# EAGLE design UberHidBoard1 (EAGLE 9.4.0)
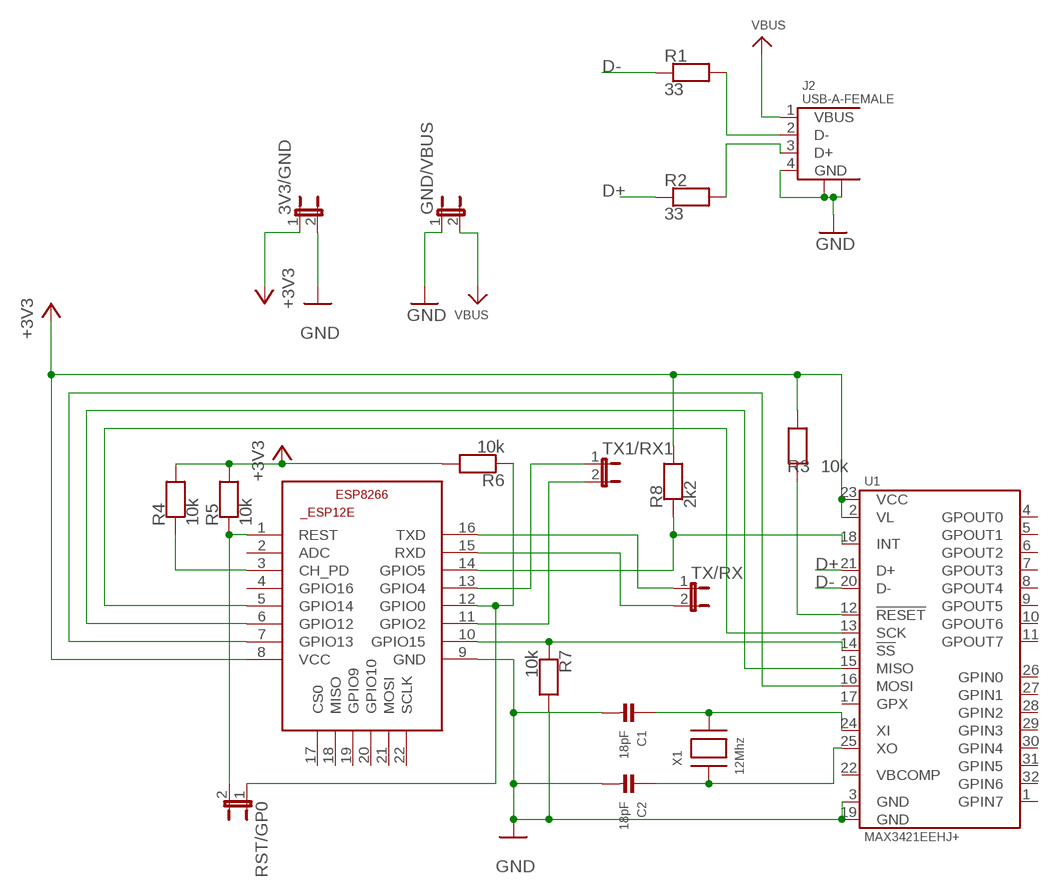
[diagram p0: schematic, sheet 1]

## Parts
3V3/GND  JUMPER2  [JUMPER2]
C1  18pF  CAP_CERAMIC0805  [0805]
C2  18pF  CAP_CERAMIC0805  [0805]
ESP8266  ESP8266-12EESP12E  [ESP8266-ESP12E]
GND/VBUS  JUMPER2  [JUMPER2]
J2  USB-A-FEMALE  [USB-A-FEMALE]
R1  33  RESISTOR0805  [0805]
R2  33  RESISTOR0805  [0805]
R3  10k  RESISTOR0805  [0805]
R4  10k  RESISTOR0805  [0805]
R5  10k  RESISTOR0805  [0805]
R6  10k  RESISTOR0805  [0805]
R7  10k  RESISTOR0805  [0805]
R8  2k2  RESISTOR0805  [0805]
RST/GP0  JUMPER2  [JUMPER2]
TX1/RX1  JUMPER2  [JUMPER2]
TX/RX  JUMPER2  [JUMPER2]
U1  MAX3421EEHJ+  [LQFP-23]
X1  12Mhz  XTAL-3.2X1.5  [XTAL3215]

## Nets
+3V3: 3V3/GND.1 ESP8266.8(VCC) R3.2 R4.2 R5.2 R6.2 R8.2 U1.2(VL) U1.23(VCC)
D+: R2.1 U1.21(D+)
D-: R1.1 U1.20(D-)
GND: 3V3/GND.2 C1.2 C2.2 ESP8266.9(GND) GND/VBUS.1 J2.4(GND) J2.P$1 J2.P$2 R7.2 U1.3(GND) U1.19(GND)
N$1: J2.2(D-) R1.2
N$2: J2.3(D+) R2.2
N$3: ESP8266.10(GPIO15) R7.1 U1.14(!SS)
N$4: ESP8266.7(GPIO13) U1.16(MOSI)
N$5: ESP8266.6(GPIO12) U1.15(MISO)
N$6: ESP8266.5(GPIO14) U1.13(SCK)
N$7: R3.1 U1.12(!RESET)
N$8: ESP8266.14(GPIO5) R8.1 U1.18(INT)
N$10: C2.1 U1.25(XO) X1.P$1
N$11: C1.1 U1.24(XI) X1.P$2
N$12: ESP8266.13(GPIO4) TX1/RX1.1
N$13: ESP8266.3(CH_PD) R4.1
N$14: ESP8266.1(REST) R5.1 RST/GP0.2
N$15: ESP8266.12(GPIO0) R6.1 RST/GP0.1
N$16: ESP8266.16(TXD) TX/RX.1
N$17: ESP8266.15(RXD) TX/RX.2
N$18: ESP8266.11(GPIO2) TX1/RX1.2
VBUS: GND/VBUS.2 J2.1(VBUS)
Unconnected: ESP8266.2(ADC) ESP8266.4(GPIO16) ESP8266.17(CS0) ESP8266.18(MISO) ESP8266.19(GPIO9) ESP8266.20(GPIO10) ESP8266.21(MOSI) ESP8266.22(SCLK) U1.1(GPIN7) U1.4(GPOUT0) U1.5(GPOUT1) U1.6(GPOUT2) U1.7(GPOUT3) U1.8(GPOUT4) U1.9(GPOUT5) U1.10(GPOUT6) U1.11(GPOUT7) U1.17(GPX) U1.22(VBCOMP) U1.26(GPIN0) U1.27(GPIN1) U1.28(GPIN2) U1.29(GPIN3) U1.30(GPIN4) U1.31(GPIN5) U1.32(GPIN6)

## Library data of the parts
3V3/GND GND/VBUS RST/GP0 TX1/RX1 TX/RX = microbuilder:JUMPER2: JUMPER - 2 Pins
C1 C2 = microbuilder:CAP_CERAMIC: Ceramic Capacitors 0402 - 0402 Surface Mount Capacitors 16pF 50V 5% [Digikey: 445-4899-2-ND] 18pF 50V 5% [Digikey: 490-1281-2-ND] 22pF 50V 5% [Digikey: 490-1283-2-ND] 68pF 50V 5% [Digikey: 490-1289-2-ND] 0.1uF 10V 10% [Digikey: 490-1318-2-ND] 1.0uF 6.3V 10% [Digikey: 490-1320-2-ND] 0603 - 0603 Surface Mount Capacitors 16 pF 50V 5% [Digikey: 445-5051-2-ND] 22 pF 50V [Digikey: PCC220ACVTR-ND] 33 pF 50V 5% [Digikey: 490-1415-1-ND] 56pF 50V 5% [Digikey: 490-1421-1-ND] 220pF 50V 5% [Digikey: 445-1285-1-ND] 680 pF 50V 2200 pF 50V 5% C0G [Digikey: 445-1297-1-ND] 5600 pF 100V 5% X7R [Digikey: 478-3711-1-ND] 0.1 µF 25V 10% [Digikey: PCC2277TR-ND] 0.22 µF 16V 10% X7R [Digikey: 445-1318-1-ND] 1.0 µF 25V 10% [Digikey: 445-5146-2-ND] 0603 - RF Specific 3pF 250V +/-0.1pF RF [Digikey: 712-1347-1-ND] 18 pF 250V 5% [Digikey: 478-3505-1-ND or 712-1322-1-ND] 56 pF 250V 5% C0G RF [Digikey: 490-4867-1-ND] 68 pF 250V RF [Digikey: 490-4868-1-ND] 0805 - 0805 Surface Mount Capacitors 220 pF 250V 2% RF Ceramic Capacitor [Digikey: 712-1398-1-ND] 1000 pF 50V 2% NP0 Ceramic Capacitor [Digikey: 478-3760-1-ND] 0.1 µF 25V 10% Ceramic Capacitor [Digikey: PCC1828TR-ND] 1.0 µF 16V 10% Ceramic Capacitor[Digikey: 490-1691-2-ND] 10.0 µF 10V 10% Ceramic Capacitor[Digikey: 709-1228-1-ND] 10.0 uF 16V 10% Ceramic Capacitor [Digikey: 478-5165-2-ND] 47 uF 6.3V 20% Ceramic Capacitor [Digikey: 587-1779-1-ND or 399-5506-1-ND] 1206 - 1206 Surface Mount Capacitors 47uF 10V 20% Ceramic Capacitor [Digikey: 490-5528-1-ND or 399-5508-1-ND or 445-6010-1-ND] 100uF 6.3V -20%, +80% Y5V Ceramic Capacitor (Digikey: 490-4512-1-ND, Mouser: 81-GRM31CF50J107ZE1L)
ESP8266 = esp12e:ESP8266-12E: ESP8266-12E Library for Eagle CAD The author not responsible for any damages or errors!. Created by Suhail jr.lt;/author>
J2 = Connectors:USB
R1-R8 = microbuilder:RESISTOR: Resistors 0402 - 0402 Surface Mount Package 22 Ohm 1% 1/16W [Digikey: 311-22.0LRTR-ND] 33 Ohm 5% 1/16W 1.0K 5% 1/16W 1.5K 5% 1/16W 2.0K 1% 1/16W 10.0K 1% 1/16W [Digikey: 311-10.0KLRTR-ND] 10.0K 5% 1/16W [Digikey: RMCF0402JT10K0TR-ND] 12.1K 1% 1/16W [Digikey: 311-22.0LRTR-ND] 100.0K 5% 1/16W 0603 - 0603 Surface Mount Package 0 Ohm 1/10 Watt 1% Resistor 15 Ohm 1/10 Watt 1% Resistor 33 Ohm 1/10 Watt 1% Resistor 49.9 Ohm 1/10 Watt 1% Resistor 100 Ohm 1/10 Watt 1% Resistor 150 Ohm 1/10 Watt 1% Resistor 240 Ohm 1/10 Watt 1% Resistor 390 Ohm 1/10 Watt 1% Resistor 560 Ohm 1/10 Watt 1% Resistor 680 Ohm 1/10 Watt 1% Resistor 750 Ohm 1/10 Watt 1% Resistor 1.0K Ohm 1/10 Watt 1% Resistor 1.5K Ohm 1/10 Watt 1% Resistor 2.0K Ohm 1/10 Watt 1% Resistor 2.2K Ohm 1/10 Watt 1% Resistor 3.3K Ohm 1/10 Watt 1% Resistor 4.7K Ohm 1/10 Watt 1% Resistor 10.0K Ohm 1/10 Watt 1% Resistor 12.0K Ohm 1/10 Watt 1% Resistor 12.1K Ohm 1/10 Watt 1% Resistor 20.0K Ohm 1/10 Watt 1% Resistor 33.0K Ohm 1/10 Watt 1% Resistor 100.0K Ohm 1/10 Watt 1% Resistor 0805 - 0805 Surface Mount Package 0 Ohm 1/8 Watt 1% Resistor 33 Ohm 1/8 Watt 1% Resistor 100 Ohm 1/8 Watt 1% Resistor 150 Ohm 1/8 Watt 1% Resistor 200 Ohm 1/8 Watt 1% Resistor 240 Ohm 1/8 Watt 1% Resistor 330 Ohm 1/8 Watt 1% Resistor 390 Ohm 1/8 Watt 1% Resistor 470 Ohm 1/8 Watt 1% Resistor 1.0K Ohm 1/8 Watt 1% Resistor 1.5K Ohm 1/8 Watt 1% Resistor 2.0K Ohm 1/8 Watt 1% Resistor 4.7K Ohm 1/8 Watt 1% Resistor 5.1K Ohm 1/8 Watt 1% Resistor 5.6K Ohm 1/8 Watt 1% Resistor 10.0K Ohm 1/8 Watt 1% Resistor 22.0K Ohm 1/8 Watt 1% Resistor 33.0K Ohm 1/8 Watt 1% Resistor 100K Ohm 1/8 Watt 1% Resistor 1206 - 1206 Surface Mount Package 2012 - 2010 Surface Mount Package 0.11 Ohm 1/2 Watt 1% Resistor - Digikey: RHM.11UCT-ND
U1 = Maxim:MAX3421
X1 = adafruit:XTAL: Low cost SMT crystals, no capacitors included http://www.ladyada.net/library/eagle

## Board
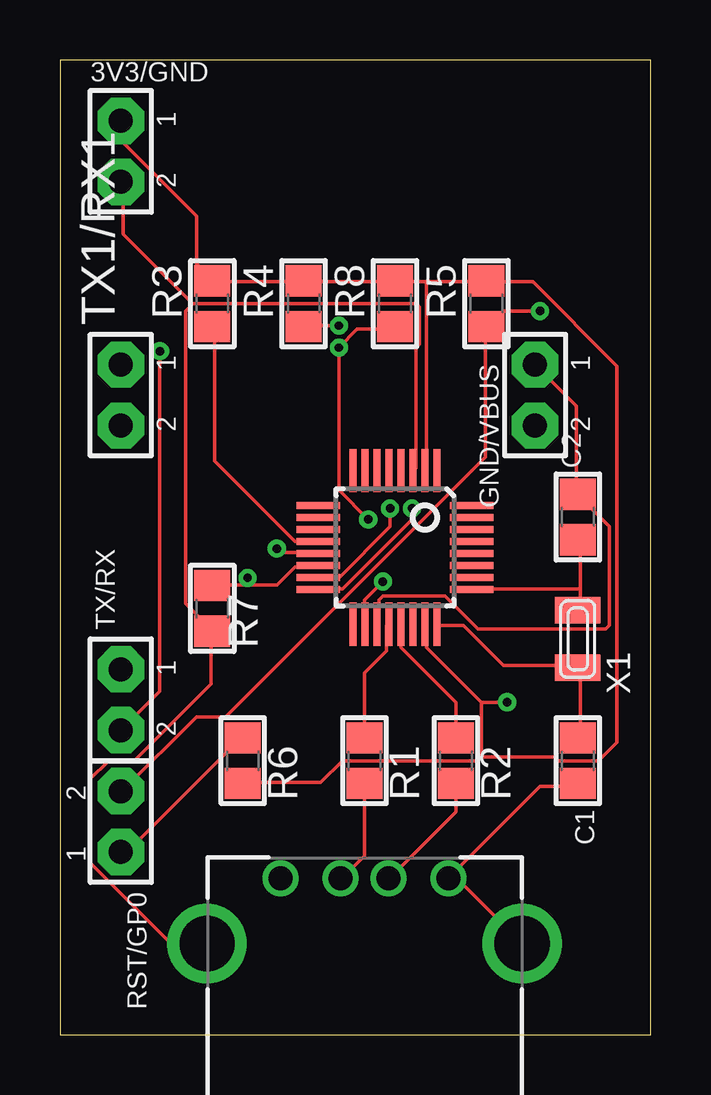
[diagram p1: board, top side]
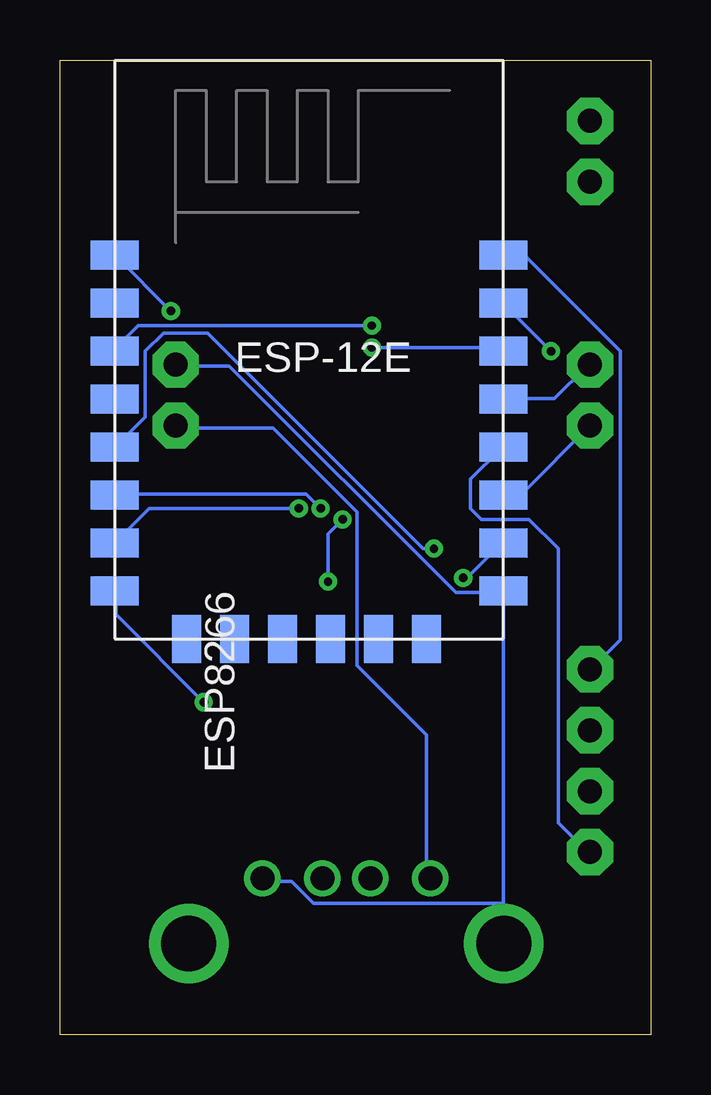
[diagram p2: board, bottom side, seen from below]

Size 24.64 x 40.64 mm. Coordinates in mm from the lower left corner, seen from the top.
Outline: 0,0 24.64,0 24.64,40.64 0,40.64 0,0
Copper layers (1*16): Top 0.035mm / dielectric 1.5mm / Bottom 0.035mm
Design rules "default": minimum track width 6mil, minimum drill 0.35mm, track to track 6mil, track to pad 6mil, pad to pad 6mil, via to via 6mil, smd to smd 6mil, copper to edge 40mil, drill to drill 6mil, minimum pad ring 10mil, minimum via ring 8mil, stop-mask expansion 4mil, vias tented up to drill 0mil, thermal gap 10mil

### Footprints (pad centres in the part's own frame; a part is rotated, then mirrored left to right if it is on the bottom)
JUMPER2 = drill 1 pad 1.93 octagon: 1 2.54,0; 2 0,0
0805 = smd 1.3 x 1.5: 1 -0.95,0; 2 0.95,0
ESP8266-ESP12E = smd 2 x 1.2: 1 -7.62,5.84; 2 -7.62,3.84; 3 -7.62,1.84; 4 -7.62,-0.16; 5 -7.62,-2.16; 6 -7.62,-4.16; 7 -7.62,-6.16; 8 -7.62,-8.16; 9 8.58,-8.16; 10 8.58,-6.16; 11 8.58,-4.16; 12 8.58,-2.16; 13 8.58,-0.16; 14 8.58,1.84; 15 8.58,3.84; 16 8.58,5.84 | smd 1.2 x 2: 17 -4.62,-10.16; 18 -2.62,-10.16; 19 -0.62,-10.16; 20 1.38,-10.16; 21 3.38,-10.16; 22 5.38,-10.16
USB-A-FEMALE = drill 1: 1 -3.5,2.71; 2 -1,2.71; 3 1,2.71; 4 3.5,2.71 | drill 2.3: P$1 6.57,0; P$2 -6.57,0
LQFP-23 = smd 1.8 x 0.3: 1 -3.2,1.75; 2 -3.2,1.25; 3 -3.2,0.75; 4 -3.2,0.25; 5 -3.2,-0.25; 6 -3.2,-0.75; 7 -3.2,-1.25; 8 -3.2,-1.75; 17 3.2,-1.75; 18 3.2,-1.25; 19 3.2,-0.75; 20 3.2,-0.25; 21 3.2,0.25; 22 3.2,0.75; 23 3.2,1.25; 24 3.2,1.75 | smd 0.3 x 1.8: 9 -1.75,-3.2; 10 -1.25,-3.2; 11 -0.75,-3.2; 12 -0.25,-3.2; 13 0.25,-3.2; 14 0.75,-3.2; 15 1.25,-3.2; 16 1.75,-3.2; 25 1.75,3.2; 26 1.25,3.2; 27 0.75,3.2; 28 0.25,3.2; 29 -0.25,3.2; 30 -0.75,3.2; 31 -1.25,3.2; 32 -1.75,3.2
XTAL3215 = smd 1.1 x 1.9: P$1 1.2,0; P$2 -1.2,0

### Placement (x,y rotation side)
3V3/GND  2.54,35.56 90 top
C1  21.59,11.43 270 top
C2  21.59,21.59 90 top
ESP8266  14.73,26.67 0 bottom
GND/VBUS  19.81,25.4 90 top
J2  12.7,3.81 0 top
R1  12.7,11.43 270 top
R2  16.51,11.43 270 top
R3  6.35,30.48 90 top
R4  10.16,30.48 90 top
R5  17.78,30.48 90 top
R6  7.62,11.43 270 top
R7  6.35,17.78 270 top
R8  13.97,30.48 90 top
RST/GP0  2.54,10.16 270 top
TX1/RX1  2.54,25.4 90 top
TX/RX  2.54,12.7 90 top
U1  13.97,20.32 270 top
X1  21.59,16.51 90 top

### Tracks (layer width: path | path; a pad name or v marks a point on that pad's centre or on a via)
+3V3  (via drill 0.35)
  Top 0.152: 17.58,11.58 17.42,11.43 11.79,11.43 10.87,10.52 7.67,10.52 R6.2 | 17.58,13.87 17.58,11.58 | 17.58,13.87 15.29,16.15 15.29,17.07 U1.23 | 17.58,13.87 v18.64,13.87 | 15.29,31.39 17.73,31.39 R5.2 17.88,31.39 19.71,31.39 23.22,27.89 23.22,12.19 22.45,11.43 20.78,11.43 20.62,11.58 17.58,11.58 | 15.29,31.39 14.07,31.39 R8.2 13.92,31.39 10.26,31.39 R4.2 10.11,31.39 6.45,31.39 R3.2 6.3,31.55 5.69,32.16 5.69,34.14 2.64,37.19 2.64,38.1 3V3/GND.1 | 15.29,31.39 15.29,23.62 U1.2
  Bottom 0.152: v18.64,13.87 22.3,17.53 22.3,18.44 ESP8266.8
D+
  Top 0.152: R2.1 16.51,13.87 14.22,16.15 14.22,17.07 U1.21
D-
  Top 0.152: R1.1 12.7,15.09 13.61,16 13.61,17.07 U1.20
GND
  Top 0.152: 5.54,30.48 14.83,30.48 14.99,30.33 14.99,28.8 14.83,28.65 14.83,23.62 U1.3 | 5.54,30.48 2.64,33.38 2.64,35.51 3V3/GND.2 | GND/VBUS.1 21.54,26.21 21.54,22.55 C2.2 21.69,22.4 22.91,21.18 22.91,17.07 22.76,16.92 17.42,16.92 16.05,18.29 13.46,18.29 13.31,18.14 13.31,17.22 U1.19 | 16.36,6.71 16.21,6.55 J2.4 16.36,6.71 | 16.36,6.71 20.02,10.36 21.54,10.36 C1.2 | 16.36,6.71 19.25,3.81 J2.P$1 | J2.P$2 4.62,3.81 1.27,7.16 1.27,10.67 2.03,11.43 3.1,11.43 6.3,14.63 6.3,16.76 R7.2 6.3,16.92 5.23,17.98 5.23,30.18 5.54,30.48
  Bottom 0.152: 6.15,5.49 6.15,3.81 J2.P$2 | 6.15,5.49 6.15,18.44 ESP8266.9 6.3,18.44 8.13,18.44 17.58,27.89 19.71,27.89 GND/VBUS.1 | 6.15,5.49 14.07,5.49 14.99,6.4 16.05,6.4 J2.4
N$1
  Top 0.152: R1.2 12.7,7.47 11.79,6.55 J2.2
N$2
  Top 0.152: R2.2 16.51,9.3 13.77,6.55 J2.3
N$3  (via drill 0.35)
  Top 0.152: 7.82,18.75 9.04,18.75 9.8,19.51 10.72,19.51 U1.14 | 7.82,18.75 6.45,18.75 R7.1 | 7.82,18.75 v7.82,19.05
  Bottom 0.152: v7.82,19.05 7.67,19.05 6.3,20.42 ESP8266.10
N$4  (via drill 0.35)
  Top 0.152: v14.68,21.95 14.68,21.49 11.79,18.59 10.87,18.59 U1.16
  Bottom 0.152: v14.68,21.95 20.93,21.95 22.3,20.57 ESP8266.7
N$5  (via drill 0.35)
  Top 0.152: v13.77,21.95 13.77,21.18 11.63,19.05 10.87,19.05 U1.15
  Bottom 0.152: v13.77,21.95 14.38,22.55 22.3,22.55 ESP8266.6
N$6  (via drill 0.35)
  Top 0.152: v9.04,20.27 9.2,20.12 10.72,20.12 U1.13
  Bottom 0.152: v9.04,20.27 9.5,20.27 18.49,29.26 20.32,29.26 21.08,28.5 21.08,25.76 22.3,24.54 ESP8266.5
N$7
  Top 0.152: R3.1 6.45,29.41 6.45,23.93 9.8,20.57 10.72,20.57 U1.12
N$8  (via drill 0.35)
  Top 0.152: R8.1 13.92,29.41 12.39,29.41 v11.63,28.65 11.63,22.71 v12.85,21.49 | v13.46,18.9 12.7,18.14 12.7,17.22 U1.18
  Bottom 0.152: v11.63,28.65 6.3,28.65 ESP8266.14 | v13.46,18.9 13.46,20.88 v12.85,21.49
N$10
  Top 0.152: 21.69,18.59 21.69,17.83 X1.P$1 | 21.69,18.59 21.69,20.57 C2.1 | 21.69,18.59 17.27,18.59 U1.25
N$11
  Top 0.152: C1.1 21.69,12.5 21.69,15.24 X1.P$2 21.54,15.39 18.49,15.39 16.82,17.07 15.75,17.07 U1.24
N$12
  Bottom 0.152: ESP8266.13 4.01,26.52 2.64,27.89 TX1/RX1.1
N$13  (via drill 0.35)
  Top 0.152: v11.63,29.57 10.26,29.57 R4.1
  Bottom 0.152: v11.63,29.57 21.39,29.57 22.3,28.65 ESP8266.3
N$14  (via drill 0.35)
  Top 0.152: RST/GP0.2 2.64,10.21 5.69,13.26 6.91,13.26 17.73,24.08 17.73,29.41 R5.1 17.88,29.57 18.49,30.18 v20.02,30.18
  Bottom 0.152: v20.02,30.18 22.3,32.46 ESP8266.1
N$15
  Top 0.152: RST/GP0.1 2.79,7.62 7.52,12.34 R6.1
  Bottom 0.152: ESP8266.12 6.3,24.38 7.52,23.16 7.52,21.95 7.06,21.49 5.08,21.49 3.86,20.27 3.86,8.84 2.64,7.62 RST/GP0.1
N$16
  Bottom 0.152: ESP8266.16 6.15,32.46 5.23,32.46 1.27,28.5 1.27,16.46 2.49,15.24 TX/RX.1
N$17  (via drill 0.35)
  Top 0.152: v4.17,28.5 4.17,14.33 TX/RX.2
  Bottom 0.152: v4.17,28.5 6.15,30.48 ESP8266.15
N$18
  Bottom 0.152: TX1/RX1.2 5.38,22.55 6.15,22.55 ESP8266.11
VBUS
  Bottom 0.152: J2.1 9.35,6.55 9.35,12.5 12.24,15.39 12.24,21.79 15.75,25.3 19.71,25.3 GND/VBUS.2